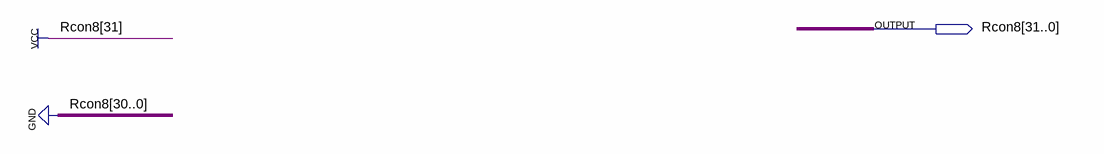
[diagram p0: schematic sheet]
// Quartus schematic Rcon8.bdf as structural Verilog: 0 symbols, 1 pins
module Rcon8 (
  output [31:0] Rcon8
);


  assign Rcon8 = 32'b10000000000000000000000000000000;
endmodule
